# EAGLE design ShiftCircuit (EAGLE 6.3)
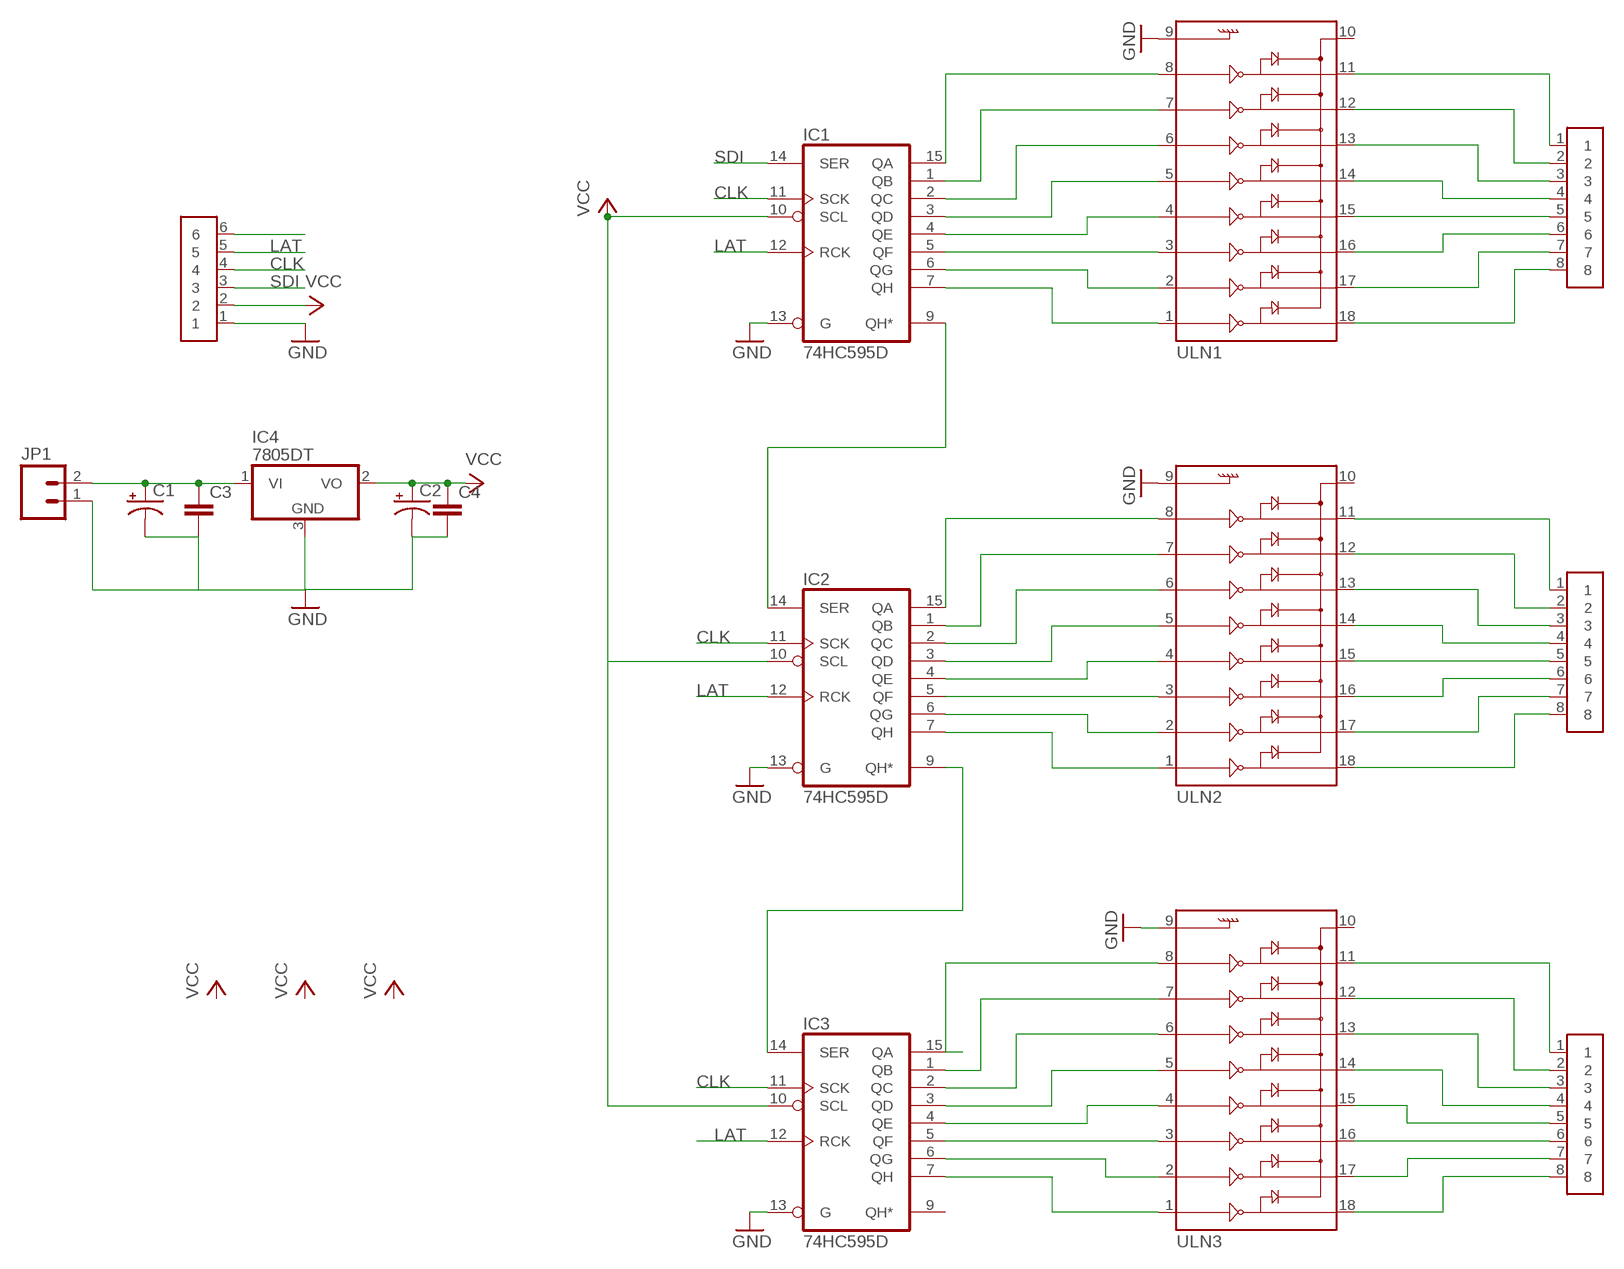
[diagram p0: schematic, sheet 1]

## Parts
C1  CAP_POL1206  [EIA3216]
C2  CAP_POL1206  [EIA3216]
C3  C-EUC0805  [C0805]
C4  C-EUC0805  [C0805]
IC1  74HC595D  [SO16]
IC2  74HC595D  [SO16]
IC3  74HC595D  [SO16]
IC4  7805DT  [TO252]
JP1  M02PTH4  [1X02_XTRA_BIG]
U$1  HEADER8  [HEADER8]
U$2  HEADER8  [HEADER8]
U$3  HEADER8  [HEADER8]
U$4  HEADER6  [HEADER6]
ULN1  ULN2803SOICW  [SO18L]
ULN2  ULN2803SOICW  [SO18L]
ULN3  ULN2803SOICW  [SO18L]

## Nets
CLK: IC1.11(SCK) IC2.11(SCK) IC3.11(SCK) U$4.4
GND: C1.C(-) C2.C(-) C3.2 C4.2 IC1.13(G) IC2.13(G) IC3.13(G) IC4.3(GND) JP1.1 U$4.1 ULN1.9 ULN2.9 ULN3.9
LAT: IC1.12(RCK) IC2.12(RCK) IC3.12(RCK) U$4.5
N$1: IC1.15(QA) ULN1.8
N$2: IC1.1(QB) ULN1.7
N$3: IC1.2(QC) ULN1.6
N$4: IC1.3(QD) ULN1.5
N$5: IC1.4(QE) ULN1.4
N$6: IC1.5(QF) ULN1.3
N$7: IC1.6(QG) ULN1.2
N$8: IC1.7(QH) ULN1.1
N$9: IC1.9(QH*) IC2.14(SER)
N$10: U$4.6
N$11: C1.A(+) C3.1 IC4.1(VI) JP1.2
N$12: IC2.15(QA) ULN2.8
N$13: IC2.1(QB) ULN2.7
N$14: IC2.2(QC) ULN2.6
N$15: IC2.3(QD) ULN2.5
N$16: IC2.4(QE) ULN2.4
N$17: IC2.9(QH*) IC3.14(SER)
N$18: IC2.5(QF) ULN2.3
N$19: IC2.6(QG) ULN2.2
N$20: IC2.7(QH) ULN2.1
N$21: IC3.5(QF) ULN3.3
N$22: IC3.1(QB) ULN3.7
N$23: IC3.2(QC) ULN3.6
N$24: IC3.3(QD) ULN3.5
N$25: IC3.4(QE) ULN3.4
N$26: U$1.1 ULN1.11
N$27: IC3.7(QH) ULN3.1
N$28: U$1.3 ULN1.13
N$29: U$1.4 ULN1.14
N$30: U$1.5 ULN1.15
N$31: U$1.6 ULN1.16
N$32: IC3.15(QA) ULN3.8
N$33: U$2.4 ULN2.14
N$34: U$2.5 ULN2.15
N$35: U$2.6 ULN2.16
N$36: U$2.7 ULN2.17
N$37: U$3.1 ULN3.11
N$38: IC3.6(QG) ULN3.2
N$39: U$3.2 ULN3.12
N$40: U$3.3 ULN3.13
N$41: U$1.2 ULN1.12
N$42: U$3.4 ULN3.14
N$43: U$3.5 ULN3.15
N$44: U$3.6 ULN3.16
N$45: U$3.7 ULN3.17
N$46: U$3.8 ULN3.18
N$47: U$1.7 ULN1.17
N$48: U$2.1 ULN2.11
N$49: U$2.2 ULN2.12
N$50: U$2.3 ULN2.13
N$51: U$1.8 ULN1.18
N$55: U$2.8 ULN2.18
SDI: IC1.14(SER) U$4.3
VCC: C2.A(+) C4.1 IC1.10(SCL) IC2.10(SCL) IC3.10(SCL) IC4.2(VO) U$4.2
Unconnected: IC3.9(QH*) ULN1.10 ULN2.10 ULN3.10

## Power pins joined to a net without a drawn wire
GND: IC1.8(GND) IC2.8(GND) IC3.8(GND)
VCC: IC1.16(VCC) IC2.16(VCC) IC3.16(VCC)

## Library data of the parts
C1 C2 = SparkFun:CAP_POL: Capacitor Polarized These are standard SMD and PTH capacitors. Normally 10uF, 47uF, and 100uF in electrolytic and tantalum varieties. Always verify the external diameter of the through hole cap, it varies with capacity, voltage, and manufacturer. The EIA devices should be standard.
C3 C4 = rcl:C-EU: CAPACITOR, European symbol
IC1-IC3 = 74xx-eu:74*595: 8-bit SHIFT REGISTER, output latch
IC4 = linear:78*: Positive VOLTAGE REGULATOR Source: http://cache.national.com/ds/LM/LM78L05.pdf http://www.fairchildsemi.com/ds/LM/LM7805.pdf
JP1 = SparkFun:M02: Header 2 Standard 2-pin 0.1" header. Use with straight break away headers (SKU : PRT-00116), right angle break away headers (PRT-00553), swiss pins (PRT-00743), machine pins (PRT-00117), and female headers (PRT-00115). Molex polarized connector foot print use with SKU : PRT-08233 with associated crimp pins and housings.
U$1-U$3 = Header:HEADER8
U$4 = Header:HEADER6
ULN1-ULN3 = SparkFun:ULN2803: Darlington Driver ULN2803 Darlington array. 500mA max per channel, 8-channel package. Spark Fun Electronics SKU : COM-00312

## Board
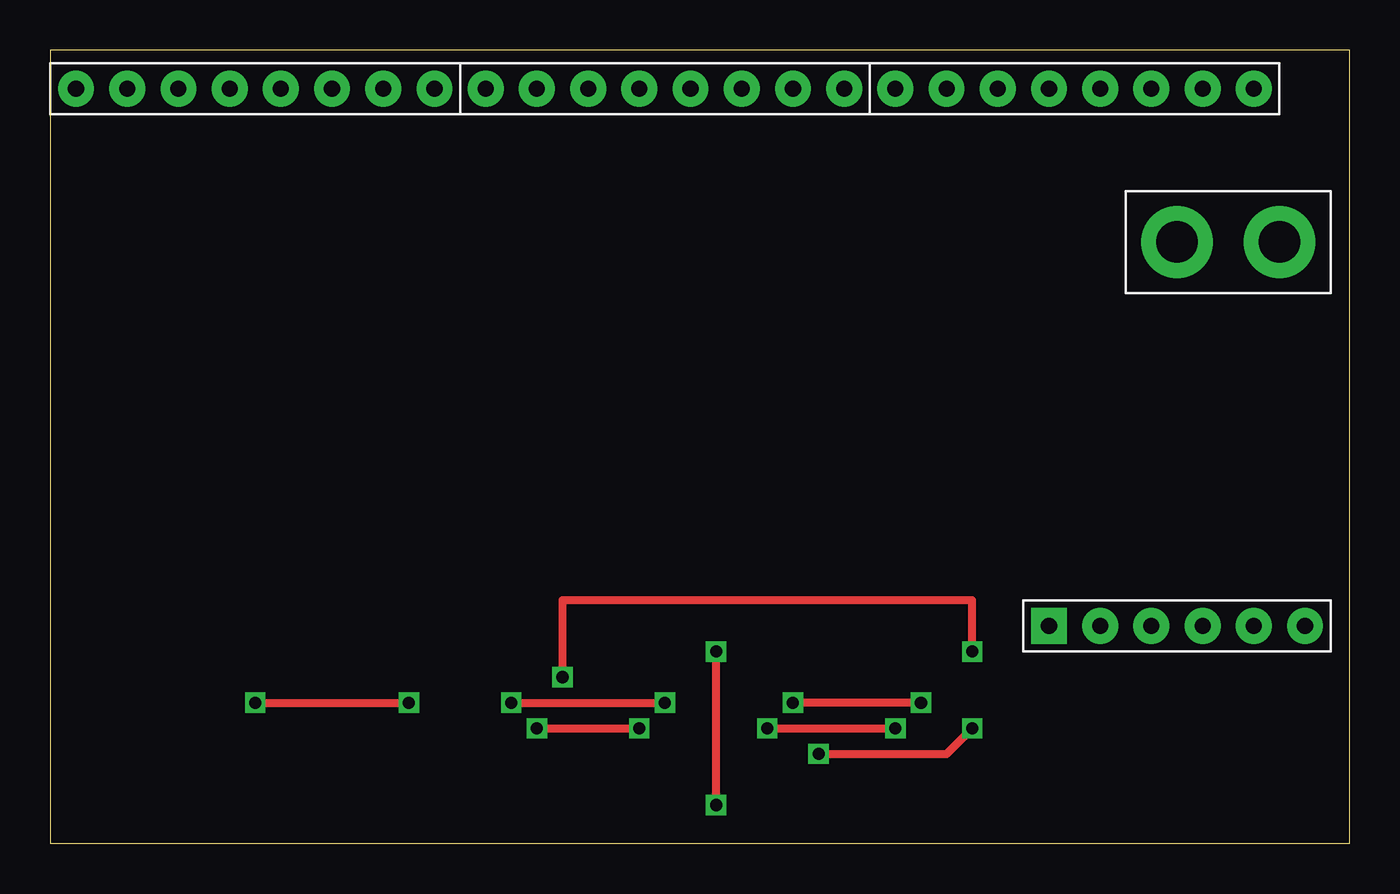
[diagram p1: board, top side]
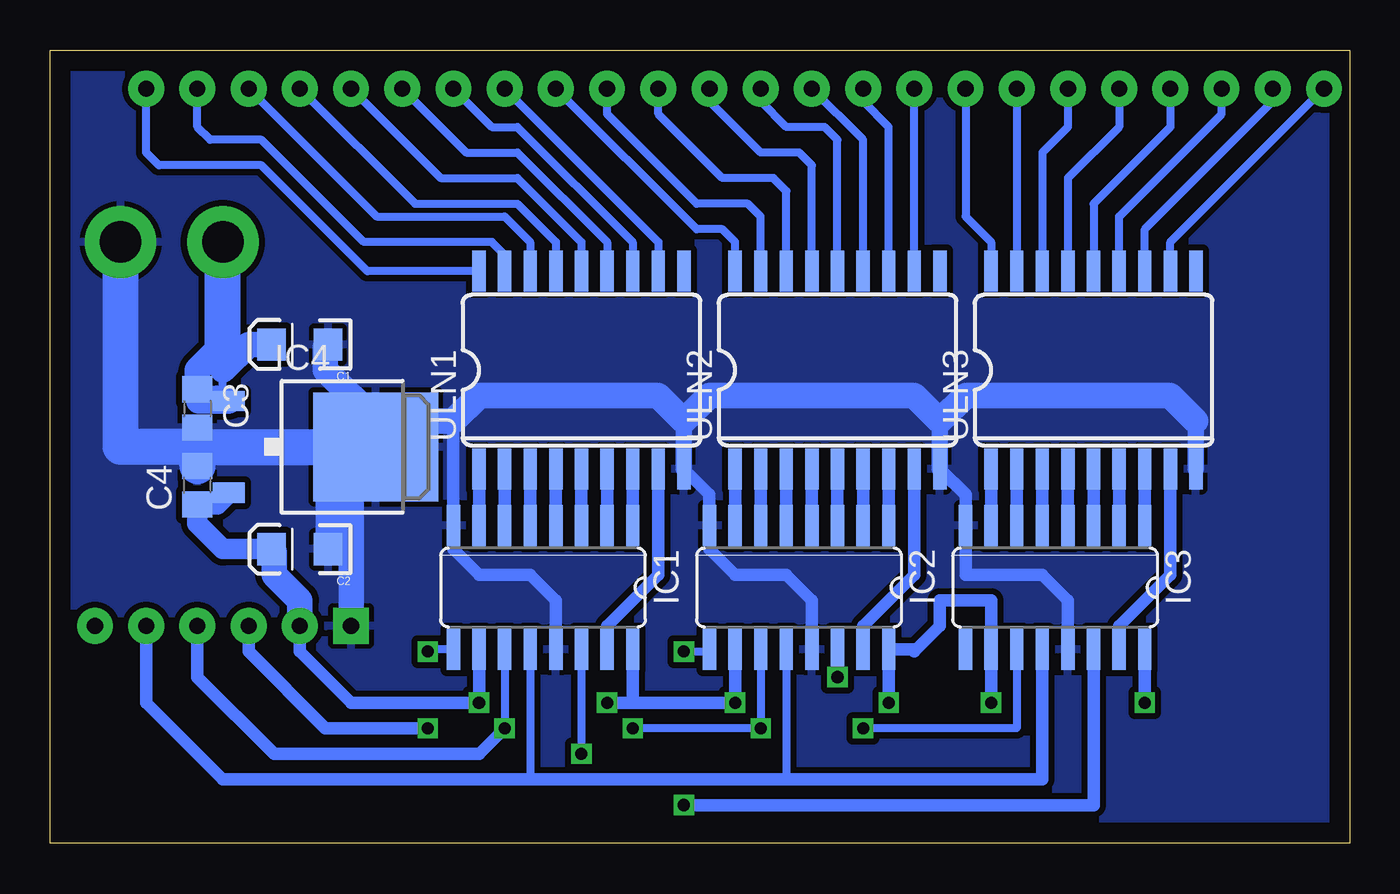
[diagram p2: board, bottom side, seen from below]

Size 64.44 x 39.36 mm. Coordinates in mm from the lower left corner, seen from the top.
Outline: 0,0 64.44,0 64.44,39.36 0,39.36 0,0
Copper layers (1*16): Top 0.035mm / dielectric 1.5mm / Bottom 0.035mm
Design rules "default": minimum track width 10mil, minimum drill 24mil, track to track 8mil, track to pad 8mil, pad to pad 8mil, via to via 8mil, smd to smd 8mil, copper to edge 40mil, drill to drill 8mil, minimum pad ring 10mil, minimum via ring 8mil, stop-mask expansion 4mil, vias tented up to drill 0mil, thermal gap 10mil

### Footprints (pad centres in the part's own frame; a part is rotated, then mirrored left to right if it is on the bottom)
EIA3216 = smd 1.4 x 1.6: A 1.4,0; C -1.4,0
C0805 = smd 1.3 x 1.5: 1 -0.95,0; 2 0.95,0
SO16 = smd 0.66 x 2.032: 1 -4.445,-3.073; 2 -3.175,-3.073; 3 -1.905,-3.073; 4 -0.635,-3.073; 5 0.635,-3.073; 6 1.905,-3.073; 7 3.175,-3.073; 8 4.445,-3.073; 9 4.445,3.073; 10 3.175,3.073; 11 1.905,3.073; 12 0.635,3.073; 13 -0.635,3.073; 14 -1.905,3.073; 15 -3.175,3.073; 16 -4.445,3.073
TO252 = smd 1 x 1.6: 1 -2.28,-4.8; 2 2.28,-4.8 | smd 5.4 x 6.2: 3 0,2.5
1X02_XTRA_BIG = drill 2.057 pad 3.556: 1 -2.54,0; 2 2.54,0
HEADER8 = drill 0.8 pad 1.778: 1 -8.89,0; 2 -6.35,0; 3 -3.81,0; 4 -1.27,0; 5 1.27,0; 6 3.81,0; 7 6.35,0; 8 8.89,0
HEADER6 = drill 0.8 pad 1.778 square: 1 -6.35,0 | drill 0.8 pad 1.778: 2 -3.81,0; 3 -1.27,0; 4 1.27,0; 5 3.81,0; 6 6.35,0
SO18L = smd 0.66 x 2.032: 1 -0.635,-4.902; 2 0.635,-4.902; 3 1.905,-4.902; 4 3.175,-4.902; 5 4.445,-4.902; 6 5.715,-4.902; 7 6.985,-4.902; 8 8.255,-4.902; 9 9.525,-4.902; 10 9.525,4.902; 11 8.255,4.902; 12 6.985,4.902; 13 5.715,4.902; 14 4.445,4.902; 15 3.175,4.902; 16 1.905,4.902; 17 0.635,4.902; 18 -0.635,4.902

### Placement (x,y rotation side)
C1  52.07,24.76 180 bottom
C2  52.07,14.6 180 bottom
C3  57.15,21.59 270 bottom
C4  57.15,17.78 90 bottom
IC1  40.01,12.7 180 bottom
IC2  27.3,12.7 180 bottom
IC3  14.6,12.7 180 bottom
IC4  50.8,19.68 270 bottom
JP1  58.42,29.84 180 top
U$1  50.8,37.46 0 top
U$2  30.48,37.46 0 top
U$3  10.16,37.46 0 top
U$4  55.88,10.79 0 top
ULN1  42.55,23.49 0 bottom
ULN2  29.84,23.49 0 bottom
ULN3  17.14,23.49 0 bottom

### Tracks (layer width: path | path; a pad name or v marks a point on that pad's centre or on a via)
CLK  (via drill 0.6)
  Top 0.406: v24.13,5.71 v29.21,5.71 | v35.56,5.71 v41.91,5.71
  Bottom 0.406: IC3.11 16.51,5.71 v24.13,5.71 | IC2.11 v29.21,5.71 v35.56,5.71 | IC1.11 v41.91,5.71
  Bottom 0.61: v41.91,5.71 43.18,4.45 53.34,4.45 57.15,8.25 U$4.4
GND
  Bottom 0.406: 19.05,17.32 19.05,17.14 20.32,18.41 ULN2.9 | 31.75,14.6 IC2.8 | IC4.3 47.03,20.95 48.26,20.95 | 50.8,24.63 C1.C | 50.67,17.31 IC4.3 | 49.53,18.45 IC4.3 | C3.2 57.15,19.68
  Bottom 0.61: 19.05,17.32 ULN2.9 | IC2.8 31.75,17.32 ULN1.9 | 44.45,20.95 IC1.8 44.45,14.6 43.18,13.34 40.64,13.34 39.37,12.06 IC1.13 | IC2.13 26.67,12.06 27.94,13.34 30.48,13.34 31.75,14.6 | IC3.13 13.97,12.06 15.24,13.34 19.05,13.34 IC3.8 19.05,17.14
  Bottom 0.813: ULN3.9 7.62,20.95 | ULN2.9 20.32,20.95 | 33.02,20.95 ULN1.9
  Bottom 1.27: 7.62,20.95 8.89,22.22 19.05,22.22 20.32,20.95 21.59,22.22 31.75,22.22 33.02,20.95 34.29,22.22 43.18,22.22 44.45,20.95 47.03,20.95 | 48.26,20.95 50.8,23.49 50.8,24.63 | C2.C 50.67,17.31 | U$4.1 49.53,18.45
  Bottom 1.778: C4.2 57.15,19.68 | 57.15,19.68 IC4.3 | 57.15,19.68 60.96,19.68 JP1.1
  pour Bottom (isolate 0.305): 0,38.73 0,0.63 64.14,0.63 64.14,38.73
LAT
  Bottom 0.406: IC2.12 27.94,3.17 | IC1.12 40.64,3.17
  Bottom 0.61: IC3.12 15.24,3.17 27.94,3.17 40.64,3.17 55.88,3.17 59.69,6.98 U$4.5
N$1
  Bottom 0.61: ULN1.8 34.29,13.34 36.83,10.79 IC1.15
N$2
  Bottom 0.61: ULN1.7 IC1.1
N$3
  Bottom 0.61: ULN1.6 IC1.2
N$4
  Bottom 0.61: ULN1.5 IC1.3
N$5
  Bottom 0.61: ULN1.4 IC1.4
N$6
  Bottom 0.61: ULN1.3 IC1.5
N$7
  Bottom 0.61: ULN1.2 IC1.6
N$8
  Bottom 0.61: ULN1.1 IC1.7
N$9  (via drill 0.6)
  Top 0.406: v45.72,9.52 45.72,12.06 25.4,12.06 v25.4,8.25
  Bottom 0.406: IC1.9 45.62,9.63 v45.72,9.52 | v25.4,8.25 IC2.14
N$11
  Bottom 0.406: 57.09,21.96 C3.1 56.2,22.54 55.88,22.22 55.88,23.49
  Bottom 1.27: IC4.1 57.09,21.96 | 55.88,23.49 54.61,24.76 C1.A | C3.1 57.15,23.49 55.88,24.76
  Bottom 1.778: 55.88,24.76 JP1.2
N$12
  Bottom 0.61: ULN2.8 21.59,13.34 24.13,10.79 IC2.15
N$13
  Bottom 0.61: ULN2.7 IC2.1
N$14
  Bottom 0.61: IC2.2 ULN2.6
N$15
  Bottom 0.61: ULN2.5 IC2.3
N$16
  Bottom 0.61: ULN2.4 IC2.4
N$17  (via drill 0.6)
  Top 0.406: v33.02,1.9 v33.02,9.52
  Bottom 0.406: v33.02,9.52 31.85,9.52 IC2.9
  Bottom 0.61: IC3.14 12.7,1.9 v33.02,1.9
N$18
  Bottom 0.61: ULN2.3 IC2.5
N$19
  Bottom 0.61: ULN2.2 IC2.6
N$20
  Bottom 0.61: ULN2.1 IC2.7
N$21
  Bottom 0.61: ULN3.3 IC3.5
N$22
  Bottom 0.61: IC3.1 ULN3.7
N$23
  Bottom 0.61: ULN3.6 IC3.2
N$24
  Bottom 0.61: IC3.3 ULN3.5
N$25
  Bottom 0.61: ULN3.4 IC3.4
N$26
  Bottom 0.406: U$1.1 34.29,29.84 ULN1.11
N$27
  Bottom 0.61: ULN3.1 IC3.7
N$28
  Bottom 0.406: U$1.3 43.81,34.29 41.27,34.29 36.83,29.84 ULN1.13
N$29
  Bottom 0.406: U$1.4 45.09,33.02 41.27,33.02 38.1,29.84 ULN1.14
N$30
  Bottom 0.406: U$1.5 46.36,31.75 41.27,31.75 39.37,29.84 ULN1.15
N$31
  Bottom 0.406: U$1.6 48.26,31.12 41.91,31.12 40.64,29.84 ULN1.16
N$32
  Bottom 0.61: ULN3.8 8.89,13.34 11.43,10.79 IC3.15
N$33
  Bottom 0.406: ULN2.14 25.4,34.93 26.04,35.56 27.94,35.56 29.21,36.83 U$2.4
N$34
  Bottom 0.406: ULN2.15 26.67,33.65 27.3,34.29 29.21,34.29 31.75,36.83 U$2.5
N$35
  Bottom 0.406: ULN2.16 27.94,32.38 28.58,33.02 31.12,33.02 34.29,36.2 U$2.6
N$36
  Bottom 0.406: ULN2.17 29.21,31.12 29.84,31.75 32.38,31.75 36.83,36.2 U$2.7
N$37
  Bottom 0.406: ULN3.11 8.89,29.84 U$3.1
N$38
  Bottom 0.61: ULN3.2 IC3.6
N$39
  Bottom 0.406: ULN3.12 10.16,30.48 3.81,36.83 U$3.2
N$40
  Bottom 0.406: ULN3.13 11.43,31.12 6.35,36.2 U$3.3
N$41
  Bottom 0.406: U$1.2 42.55,35.56 41.27,35.56 35.56,29.84 ULN1.12
N$42
  Bottom 0.406: U$3.4 8.89,35.56 12.7,31.75 ULN3.14
N$43
  Bottom 0.406: U$3.5 11.43,35.56 13.97,33.02 ULN3.15
N$44
  Bottom 0.406: U$3.6 13.97,35.56 15.24,34.29 ULN3.16
N$45
  Bottom 0.406: U$3.7 ULN3.17
N$46
  Bottom 0.406: U$3.8 19.05,31.12 17.78,29.84 ULN3.18
N$47
  Bottom 0.406: ULN1.17 41.91,29.21 42.55,29.84 48.9,29.84 53.97,34.93 56.52,34.93 57.15,35.56 U$1.7
N$48
  Bottom 0.406: ULN2.11 U$2.1
N$49
  Bottom 0.406: ULN2.12 22.86,35.56 24.13,36.83 U$2.2
N$50
  Bottom 0.406: ULN2.13 24.13,34.93 U$2.3
N$51
  Bottom 0.406: ULN1.18 48.72,28.4 53.97,33.65 59.06,33.65 59.69,34.29 U$1.8
N$55
  Bottom 0.406: ULN2.18 30.48,29.84 31.12,30.48 32.38,30.48 U$2.8
SDI  (via drill 0.6)
  Top 0.406: v38.1,4.45 44.45,4.45 v45.72,5.71
  Bottom 0.406: IC1.14 v38.1,4.45
  Bottom 0.61: v45.72,5.71 50.8,5.71 54.61,9.52 U$4.3
VCC  (via drill 0.6)
  Top 0.406: v10.16,6.98 v17.78,6.98 | v43.18,6.98 v36.83,6.98 | v22.86,6.98 v30.48,6.98
  Bottom 0.406: 21.69,9.63 21.59,9.52 | 53.34,14.47 C2.A
  Bottom 0.61: 21.69,9.63 IC2.16 v22.86,6.98 | 21.59,9.52 20.32,10.79 20.32,12.06 17.78,12.06 IC3.10 v17.78,6.98 | 35.56,6.98 v30.48,6.98 IC2.10 | IC1.16 35.56,6.98 | v36.83,6.98 35.56,6.98 | IC1.10 v43.18,6.98 49.53,6.98 52.07,9.52 U$4.2 | v10.16,6.98 IC3.16
  Bottom 1.016: C2.A 55.88,14.6 57.15,15.88 C4.1 56.17,16.83 IC4.2
  Bottom 1.27: U$4.2 52.07,12.06 53.34,13.34 53.34,14.47